# EAGLE design mux_ic (EAGLE 9.6.1)
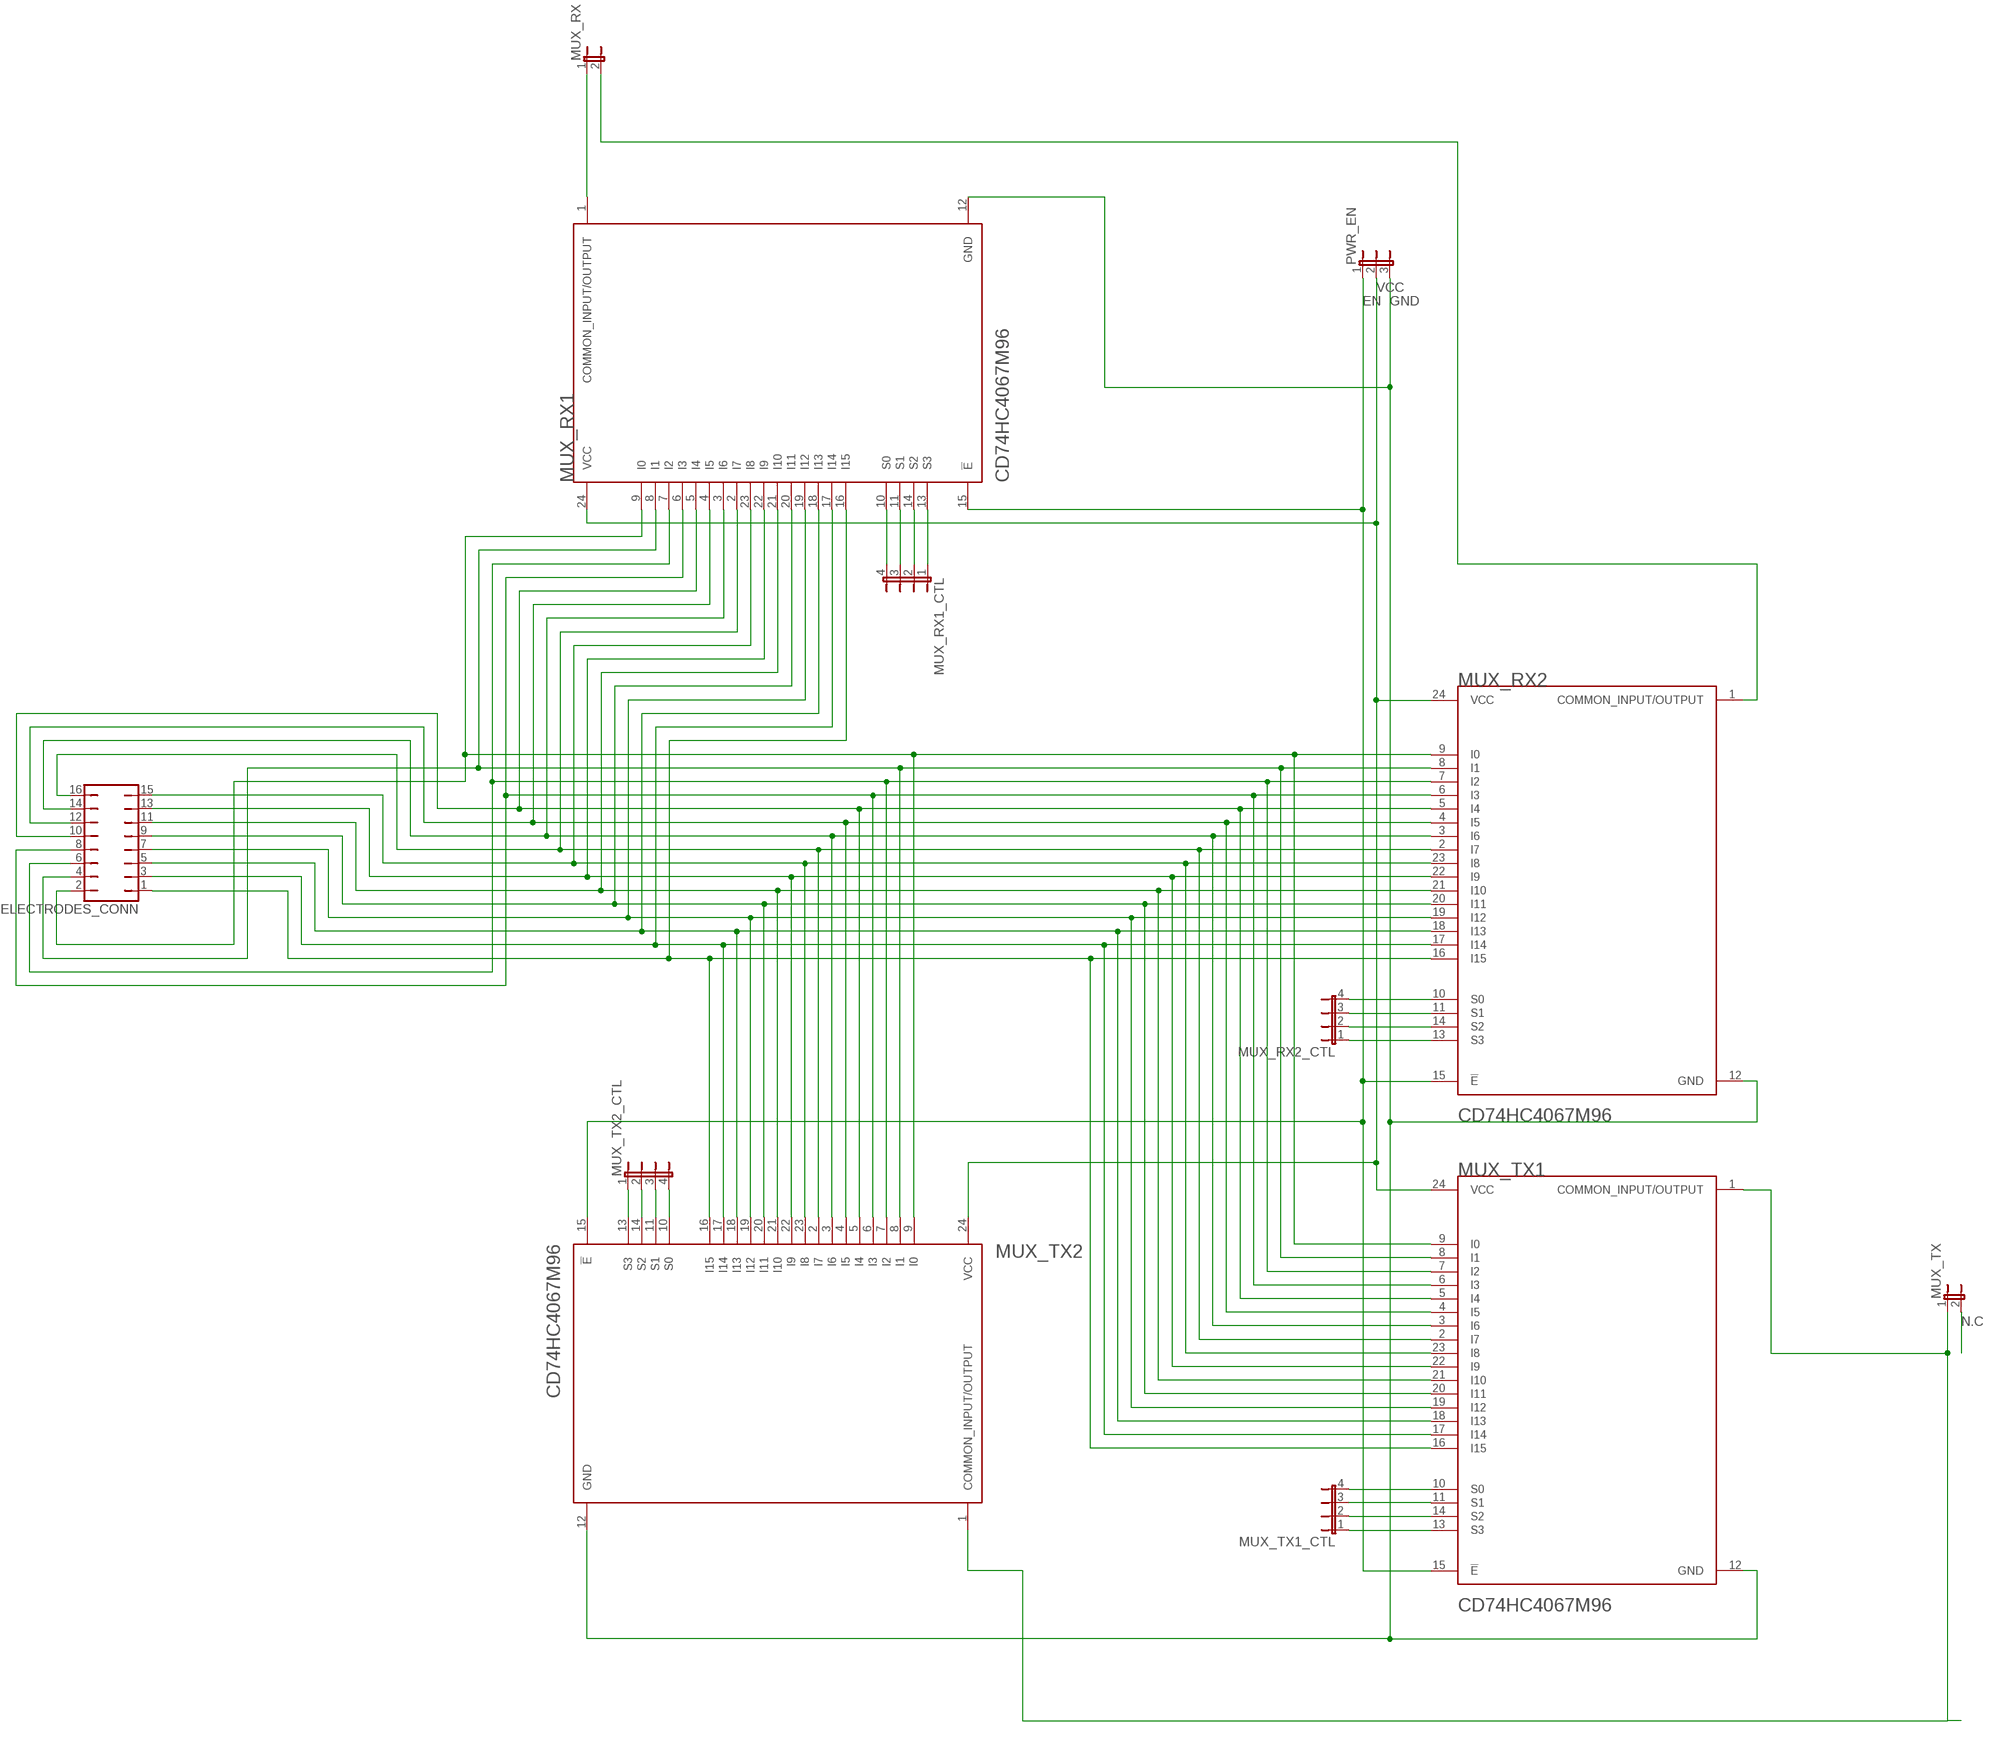
[diagram p0: schematic, sheet 1]

## Parts
ELECTRODES_CONN  JP8Q  [JP8Q]
MUX_RX  JP1E  [JP1]
MUX_RX1  TEXAS_INSTRUMENTS_CD74HC4067M96TEXAS_INSTRUMENTS_CD74HC4067M96_0_0  [TEXAS_INSTRUMENTS_CD74HC4067M96_0]
MUX_RX1_CTL  JP4E  [JP4]
MUX_RX2  TEXAS_INSTRUMENTS_CD74HC4067M96TEXAS_INSTRUMENTS_CD74HC4067M96_0_0  [TEXAS_INSTRUMENTS_CD74HC4067M96_0]
MUX_RX2_CTL  JP4E  [JP4]
MUX_TX  JP1E  [JP1]
MUX_TX1  TEXAS_INSTRUMENTS_CD74HC4067M96TEXAS_INSTRUMENTS_CD74HC4067M96_0_0  [TEXAS_INSTRUMENTS_CD74HC4067M96_0]
MUX_TX1_CTL  JP4E  [JP4]
MUX_TX2  TEXAS_INSTRUMENTS_CD74HC4067M96TEXAS_INSTRUMENTS_CD74HC4067M96_0_0  [TEXAS_INSTRUMENTS_CD74HC4067M96_0]
MUX_TX2_CTL  JP4E  [JP4]
PWR_EN  JP2W  [JP2W]

## Nets
EN: MUX_RX1.15(!E!) MUX_RX2.15(!E!) MUX_TX1.15(!E!) MUX_TX2.15(!E!) PWR_EN.1
GND: MUX_RX1.12(GND) MUX_RX2.12(GND) MUX_TX1.12(GND) MUX_TX2.12(GND) PWR_EN.3
N$1: ELECTRODES_CONN.2 MUX_RX1.9(I0) MUX_RX2.9(I0) MUX_TX1.9(I0) MUX_TX2.9(I0)
N$2: ELECTRODES_CONN.1 ELECTRODES_CONN.3 ELECTRODES_CONN.4 ELECTRODES_CONN.5 ELECTRODES_CONN.6 ELECTRODES_CONN.7 ELECTRODES_CONN.8 ELECTRODES_CONN.9 ELECTRODES_CONN.10 ELECTRODES_CONN.12 ELECTRODES_CONN.13 ELECTRODES_CONN.14 ELECTRODES_CONN.15 ELECTRODES_CONN.16 MUX_RX1.2(I7) MUX_RX1.3(I6) MUX_RX1.4(I5) MUX_RX1.5(I4) MUX_RX1.6(I3) MUX_RX1.7(I2) MUX_RX1.8(I1) MUX_RX1.16(I15) MUX_RX1.17(I14) MUX_RX1.18(I13) MUX_RX1.19(I12) MUX_RX1.20(I11) MUX_RX1.22(I9) MUX_RX1.23(I8) MUX_RX2.2(I7) MUX_RX2.3(I6) MUX_RX2.4(I5) MUX_RX2.5(I4) MUX_RX2.6(I3) MUX_RX2.7(I2) MUX_RX2.8(I1) MUX_RX2.16(I15) MUX_RX2.17(I14) MUX_RX2.18(I13) MUX_RX2.19(I12) MUX_RX2.20(I11) MUX_RX2.22(I9) MUX_RX2.23(I8) MUX_TX1.2(I7) MUX_TX1.3(I6) MUX_TX1.4(I5) MUX_TX1.5(I4) MUX_TX1.6(I3) MUX_TX1.7(I2) MUX_TX1.8(I1) MUX_TX1.16(I15) MUX_TX1.17(I14) MUX_TX1.18(I13) MUX_TX1.19(I12) MUX_TX1.20(I11) MUX_TX1.22(I9) MUX_TX1.23(I8) MUX_TX2.2(I7) MUX_TX2.3(I6) MUX_TX2.4(I5) MUX_TX2.5(I4) MUX_TX2.6(I3) MUX_TX2.7(I2) MUX_TX2.8(I1) MUX_TX2.16(I15) MUX_TX2.17(I14) MUX_TX2.18(I13) MUX_TX2.19(I12) MUX_TX2.20(I11) MUX_TX2.22(I9) MUX_TX2.23(I8)
N$3: MUX_RX1.1(COMMON_INPUT/OUTPUT) MUX_RX.1
N$4: MUX_RX2.1(COMMON_INPUT/OUTPUT) MUX_RX.2
N$5: MUX_TX1.1(COMMON_INPUT/OUTPUT) MUX_TX2.1(COMMON_INPUT/OUTPUT) MUX_TX.1
N$6: ELECTRODES_CONN.11 MUX_RX1.21(I10) MUX_RX2.21(I10) MUX_TX1.21(I10) MUX_TX2.21(I10)
N$11: MUX_TX1.10(S0) MUX_TX1_CTL.4
N$12: MUX_TX1.11(S1) MUX_TX1_CTL.3
N$13: MUX_TX1.14(S2) MUX_TX1_CTL.2
N$14: MUX_TX1.13(S3) MUX_TX1_CTL.1
N$15: MUX_TX2.13(S3) MUX_TX2_CTL.1
N$16: MUX_TX2.14(S2) MUX_TX2_CTL.2
N$17: MUX_TX2.11(S1) MUX_TX2_CTL.3
N$18: MUX_TX2.10(S0) MUX_TX2_CTL.4
N$19: MUX_RX2.10(S0) MUX_RX2_CTL.4
N$20: MUX_RX2.11(S1) MUX_RX2_CTL.3
N$21: MUX_RX2.14(S2) MUX_RX2_CTL.2
N$22: MUX_RX2.13(S3) MUX_RX2_CTL.1
N$23: MUX_RX1.10(S0) MUX_RX1_CTL.4
N$24: MUX_RX1.11(S1) MUX_RX1_CTL.3
N$25: MUX_RX1.14(S2) MUX_RX1_CTL.2
N$26: MUX_RX1.13(S3) MUX_RX1_CTL.1
N.C: MUX_TX.2
VCC: MUX_RX1.24(VCC) MUX_RX2.24(VCC) MUX_TX1.24(VCC) MUX_TX2.24(VCC) PWR_EN.2

## Library data of the parts
ELECTRODES_CONN = jumper:JP8Q: JUMPER
MUX_RX MUX_TX = jumper:JP1E: JUMPER
MUX_RX1 MUX_RX2 MUX_TX1 MUX_TX2 = Texas Instruments - CD74HC4067M96:TEXAS_INSTRUMENTS_CD74HC4067M96: High-speed CMOS 16-channel analog multiplexer/demultiplexer 24-SOIC -55 to 125; AMBIENT_TEMPERATURE_RANGE_HIGH: +125°C; AMBIENT_TEMPERATURE_RANGE_LOW: -55°C; AUTOMOTIVE: No; CENTROID_NOT_SPECIFIED: No; DATASHEET: http://www.ti.com/lit/ds/symlink/cd74hc4067.pdf; DEVICE_CLASS_L1: Integrated Circuits (ICs); DEVICE_CLASS_L2: Logic ICs; DEVICE_CLASS_L3: Multiplexers; DIGIKEY_DESCRIPTION: IC MUX/DEMUX 1X16 24SOIC; DIGIKEY_PART_NUMBER: 296-29408-1-ND; FOOTPRINT_PARAMETERS_1: {"fp_type":"SOIC_narrow","params":{"N":{"nom":24,"long name":"Number of leads","min":null,"max":null,"short name":"N","type":"count"},"A":{"nom":false,"long name":"Height","min":false,"max":2650000,"short name":"A","type":"measurement"},"A1":{"nom":false,"long name":"Package clearance","min":100000,"max":300000,"short name":"A1","type":"measurement"},"A2":{"nom":false,"long name":"Package height","min":false,"max":2550000,"short name":"A2","type":"measurement"},"D":{"nom":false,"long name":"Package length","min":15200000,"max":15600000,"short name":"D","type":"measurement"},"E":{"nom":false,"long name":"Width w/ leads","min":9970000,"max":10630000,"short name":"E","type":"measurement"},"E1":{"nom":false,"long name":"Package width","min":7400000,"max":7600000,"short name":"E1","type":"measurement"},"B":{"nom":false,"long name":"Lead width","min":310000,"max":510000,"short name":"B","type":"measurement"},"C":{"nom":false,"long name":"Lead thickness","min":200000,"max":330000,"short name":"C","type":"measurement"},"e":{"nom":1270000,"long name":"Lead pitch","min":null,"max":null,"short name":"e","type":"measurement"},"L":{"nom":false,"long name":"Lead foot length","min":400000,"max":1270000,"short name":"L","type":"measurement"},"PHI":{"nom":false,"long name":"Lead foot angle","min":0,"max":8000000,"short name":"PHI","type":"measurement"},"HT":{"default":"No","long name":"Thermal pad","type":"multichoiceparent","short name":"HT","children":[]},"offset x":{"nom":0,"long name":"X Center offset","min":null,"max":null,"short name":"offset x","type":"measurement"},"offset y":{"nom":0,"long name":"Y Center offset","min":null,"max":null,"short name":"offset y","type":"measurement"},"LS":{"default":"Rounded rectangle","long name":"Land shape","type":"multichoice","short name":"LS"},"LS1":{"default":"Rectangle","long name":"Land shape (Pin 1)","type":"multichoice","short name":"LS1"},"solder toe":{"nom":550000,"long name":"Solder fillet (toe)","min":null,"max":null,"short name":"solder toe","type":"fixedmeasurement"},"solder heel":{"nom":450000,"long name":"Solder fillet (heel)","min":null,"max":null,"short name":"solder heel","type":"fixedmeasurement"},"solder side":{"nom":50000,"long name":"Solder fillet (side)","min":null,"max":null,"short name":"solder side","type":"fixedmeasurement"},"courtyard":{"nom":500000,"long name":"Courtyard","min":null,"max":null,"short name":"courtyard","type":"fixedmeasurement"},"SF":{"default":"A","long name":"Packing level","type":"multichoiceparent","short name":"SF","help":"http://support.upverter.com/customer/portal/articles/978783-what-is-a-footprint-packing-level","children":["solder toe","solder heel","solder side","courtyard"]}}}; FOOTPRINT_PARAMETERS_2: {"fp_type":"SOIC_narrow","params":{"N":{"nom":24,"long name":"Number of leads","min":null,"max":null,"short name":"N","type":"count"},"A":{"nom":false,"long name":"Height","min":false,"max":2650000,"short name":"A","type":"measurement"},"A1":{"nom":false,"long name":"Package clearance","min":100000,"max":300000,"short name":"A1","type":"measurement"},"A2":{"nom":false,"long name":"Package height","min":false,"max":2550000,"short name":"A2","type":"measurement"},"D":{"nom":false,"long name":"Package length","min":15200000,"max":15600000,"short name":"D","type":"measurement"},"E":{"nom":false,"long name":"Width w/ leads","min":9970000,"max":10630000,"short name":"E","type":"measurement"},"E1":{"nom":false,"long name":"Package width","min":7400000,"max":7600000,"short name":"E1","type":"measurement"},"B":{"nom":false,"long name":"Lead width","min":310000,"max":510000,"short name":"B","type":"measurement"},"C":{"nom":false,"long name":"Lead thickness","min":200000,"max":330000,"short name":"C","type":"measurement"},"e":{"nom":1270000,"long name":"Lead pitch","min":null,"max":null,"short name":"e","type":"measurement"},"L":{"nom":false,"long name":"Lead foot length","min":400000,"max":1270000,"short name":"L","type":"measurement"},"PHI":{"nom":false,"long name":"Lead foot angle","min":0,"max":8000000,"short name":"PHI","type":"measurement"},"HT":{"default":"No","long name":"Thermal pad","type":"multichoiceparent","short name":"HT","children":[]},"offset x":{"nom":0,"long name":"X Center offset","min":null,"max":null,"short name":"offset x","type":"measurement"},"offset y":{"nom":0,"long name":"Y Center offset","min":null,"max":null,"short name":"offset y","type":"measurement"},"LS":{"default":"Rounded rectangle","long name":"Land shape","type":"multichoice","short name":"LS"},"LS1":{"default":"Rectangle","long name":"Land shape (Pin 1)","type":"multichoice","short name":"LS1"},"solder toe":{"nom":350000,"long name":"Solder fillet (toe)","min":null,"max":null,"short name":"solder toe","type":"fixedmeasurement"},"solder heel":{"nom":350000,"long name":"Solder fillet (heel)","min":null,"max":null,"short name":"solder heel","type":"fixedmeasurement"},"solder side":{"nom":30000,"long name":"Solder fillet (side)","min":null,"max":null,"short name":"solder side","type":"fixedmeasurement"},"courtyard":{"nom":250000,"long name":"Courtyard","min":null,"max":null,"short name":"courtyard","type":"fixedmeasurement"},"SF":{"default":"B","long name":"Packing level","type":"multichoiceparent","short name":"SF","help":"http://support.upverter.com/customer/portal/articles/978783-what-is-a-footprint-packing-level","children":["solder toe","solder heel","solder side","courtyard"]}}}; FOOTPRINT_PARAMETERS_3: {"fp_type":"SOIC_narrow","params":{"N":{"nom":24,"long name":"Number of leads","min":null,"max":null,"short name":"N","type":"count"},"A":{"nom":false,"long name":"Height","min":false,"max":2650000,"short name":"A","type":"measurement"},"A1":{"nom":false,"long name":"Package clearance","min":100000,"max":300000,"short name":"A1","type":"measurement"},"A2":{"nom":false,"long name":"Package height","min":false,"max":2550000,"short name":"A2","type":"measurement"},"D":{"nom":false,"long name":"Package length","min":15200000,"max":15600000,"short name":"D","type":"measurement"},"E":{"nom":false,"long name":"Width w/ leads","min":9970000,"max":10630000,"short name":"E","type":"measurement"},"E1":{"nom":false,"long name":"Package width","min":7400000,"max":7600000,"short name":"E1","type":"measurement"},"B":{"nom":false,"long name":"Lead width","min":310000,"max":510000,"short name":"B","type":"measurement"},"C":{"nom":false,"long name":"Lead thickness","min":200000,"max":330000,"short name":"C","type":"measurement"},"e":{"nom":1270000,"long name":"Lead pitch","min":null,"max":null,"short name":"e","type":"measurement"},"L":{"nom":false,"long name":"Lead foot length","min":400000,"max":1270000,"short name":"L","type":"measurement"},"PHI":{"nom":false,"long name":"Lead foot angle","min":0,"max":8000000,"short name":"PHI","type":"measurement"},"HT":{"default":"No","long name":"Thermal pad","type":"multichoiceparent","short name":"HT","children":[]},"offset x":{"nom":0,"long name":"X Center offset","min":null,"max":null,"short name":"offset x","type":"measurement"},"offset y":{"nom":0,"long name":"Y Center offset","min":null,"max":null,"short name":"offset y","type":"measurement"},"LS":{"default":"Rounded rectangle","long name":"Land shape","type":"multichoice","short name":"LS"},"LS1":{"default":"Rectangle","long name":"Land shape (Pin 1)","type":"multichoice","short name":"LS1"},"solder toe":{"nom":150000,"long name":"Solder fillet (toe)","min":null,"max":null,"short name":"solder toe","type":"fixedmeasurement"},"solder heel":{"nom":250000,"long name":"Solder fillet (heel)","min":null,"max":null,"short name":"solder heel","type":"fixedmeasurement"},"solder side":{"nom":10000,"long name":"Solder fillet (side)","min":null,"max":null,"short name":"solder side","type":"fixedmeasurement"},"courtyard":{"nom":100000,"long name":"Courtyard","min":null,"max":null,"short name":"courtyard","type":"fixedmeasurement"},"SF":{"default":"C","long name":"Packing level","type":"multichoiceparent","short name":"SF","help":"http://support.upverter.com/customer/portal/articles/978783-what-is-a-footprint-packing-level","children":["solder toe","solder heel","solder side","courtyard"]}}}; FOOTPRINT_VARIANT_NAME_0: Recommended_Land_Pattern; FOOTPRINT_VARIANT_NAME_1: IPC_A; FOOTPRINT_VARIANT_NAME_2: IPC_B; FOOTPRINT_VARIANT_NAME_3: IPC_C; HEIGHT: 2.65mm; IPC_LAND_PATTERN_NAME: SOIC127P1030X265-24; LEAD_FREE: Yes; LOGIC_FUNCTION_DESC: Non-Inverting; MAX_JUNCTION_TEMP: +150°C; MAX_SUPPLY_VOLTAGE: 6V; MF: Texas Instruments; MFG_PACKAGE_IDENT: DW0024A; MFG_PACKAGE_IDENT_COMPONENT_ID: 7ddb0374575ad7a2; MFG_PACKAGE_IDENT_DATE: 0; MFG_PACKAGE_IDENT_REV: 0; MIN_SUPPLY_VOLTAGE: 2V; MOUSER_DESCRIPTION: Multiplexer Switch ICs Hi-Spd CMOS 16Ch Anl Mltplxr/Demltplxr; MOUSER_PART_NUMBER: 595-CD74HC4067M96; MPN: CD74HC4067M96; NUMBER_OF_CIRCUITS: 1; NUMBER_OF_INPUTS: 16; NUMBER_OF_OUTPUTS: 1; PACKAGE: SOIC24; PREFIX: U; PROPAGATION_DELAY: 6ns; QUIESCENT_CURRENT: 8uA; ROHS: Yes; STANDOFF_HEIGHT: 0.1mm; TEMPERATURE_RANGE_HIGH: +125°C; TEMPERATURE_RANGE_LOW: -55°C; VERIFICATION_VERSION: 0.0.0.3
MUX_RX1_CTL MUX_RX2_CTL MUX_TX1_CTL MUX_TX2_CTL = jumper:JP4E: JUMPER
PWR_EN = jumper:JP2W: JUMPER

## Board
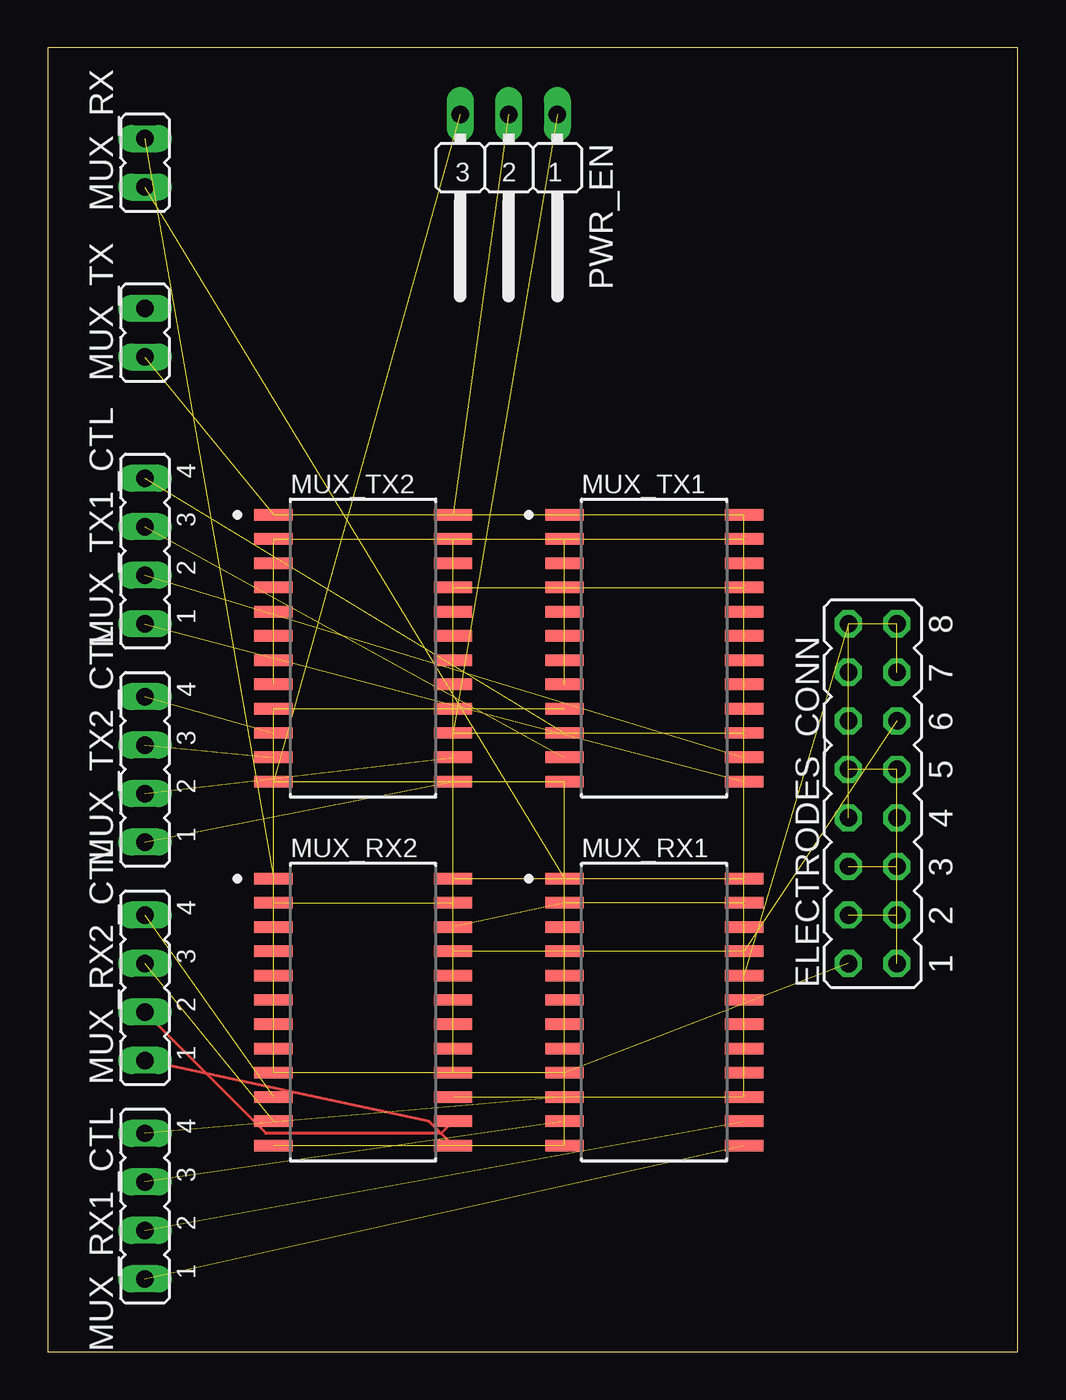
[diagram p1: board, top side]

Size 50.78 x 68.25 mm. Coordinates in mm from the lower left corner, seen from the top.
Outline: 0,0 50.78,0 50.78,68.25 0,68.25 0,0
Copper layers (1*16): Top 0.035mm / dielectric 1.5mm / Bottom 0.035mm
Design rules "default": minimum track width 6mil, minimum drill 0.35mm, track to track 6mil, track to pad 6mil, pad to pad 6mil, via to via 6mil, smd to smd 6mil, copper to edge 40mil, drill to drill 6mil, minimum pad ring 10mil, minimum via ring 8mil, stop-mask expansion 4mil, vias tented up to drill 0mil, thermal gap 10mil

### Footprints (pad centres in the part's own frame; a part is rotated, then mirrored left to right if it is on the bottom)
JP8Q = drill 0.914 octagon: 1 -8.89,-1.27; 2 -8.89,1.27; 3 -6.35,-1.27; 4 -6.35,1.27; 5 -3.81,-1.27; 6 -3.81,1.27; 7 -1.27,-1.27; 8 -1.27,1.27; 9 1.27,-1.27; 10 1.27,1.27; 11 3.81,-1.27; 12 3.81,1.27; 13 6.35,-1.27; 14 6.35,1.27; 15 8.89,-1.27; 16 8.89,1.27
JP1 = drill 0.914 long: 1 0,-1.27; 2 0,1.27
TEXAS_INSTRUMENTS_CD74HC4067M96_0 = smd 2 x 0.6: 1 -4.7,6.985; 2 -4.7,5.715; 3 -4.7,4.445; 4 -4.7,3.175; 5 -4.7,1.905; 6 -4.7,0.635; 7 -4.7,-0.635; 8 -4.7,-1.905; 9 -4.7,-3.175; 10 -4.7,-4.445; 11 -4.7,-5.715; 12 -4.7,-6.985; 13 4.7,-6.985; 14 4.7,-5.715; 15 4.7,-4.445; 16 4.7,-3.175; 17 4.7,-1.905; 18 4.7,-0.635; 19 4.7,0.635; 20 4.7,1.905; 21 4.7,3.175; 22 4.7,4.445; 23 4.7,5.715; 24 4.7,6.985 | smd 1.95 x 0.55: SMD_25 4.7,-6.985; SMD_26 4.7,-5.715; SMD_27 4.7,-4.445; SMD_28 4.7,-3.175; SMD_29 4.7,-1.905; SMD_30 4.7,-0.635; SMD_31 4.7,0.635; SMD_32 4.7,1.905; SMD_33 4.7,3.175; SMD_34 4.7,4.445; SMD_35 4.7,5.715; SMD_36 4.7,6.985; SMD_37 -4.7,6.985; SMD_38 -4.7,5.715; SMD_39 -4.7,4.445; SMD_40 -4.7,3.175; SMD_41 -4.7,1.905; SMD_42 -4.7,0.635; SMD_43 -4.7,-0.635; SMD_44 -4.7,-1.905; SMD_45 -4.7,-3.175; SMD_46 -4.7,-4.445; SMD_47 -4.7,-5.715; SMD_48 -4.7,-6.985
JP4 = drill 0.914 long: 1 -3.81,0; 2 -1.27,0; 3 1.27,0; 4 3.81,0
JP2W = drill 0.914 long: 1 -2.54,-1.27; 2 0,-1.27; 3 2.54,-1.27

### Placement (x,y rotation side)
ELECTRODES_CONN  43.18,29.21 90 top
MUX_RX  5.08,62.23 0 top
MUX_RX1  31.75,17.78 0 top
MUX_RX1_CTL  5.08,7.62 90 top
MUX_RX2  16.51,17.78 0 top
MUX_RX2_CTL  5.08,19.05 90 top
MUX_TX  5.08,53.34 0 top
MUX_TX1  31.75,36.83 0 top
MUX_TX1_CTL  5.08,41.91 90 top
MUX_TX2  16.51,36.83 0 top
MUX_TX2_CTL  5.08,30.48 90 top
PWR_EN  24.13,63.5 180 top

### Tracks (layer width: path | path; a pad name or v marks a point on that pad's centre or on a via)
EN  (4 unrouted)
GND  (4 unrouted)
N$1  (4 unrouted)
N$2  (69 unrouted)
N$3  (1 unrouted)
N$4  (1 unrouted)
N$5  (2 unrouted)
N$6  (4 unrouted)
N$11  (1 unrouted)
N$12  (1 unrouted)
N$13  (1 unrouted)
N$14  (1 unrouted)
N$15  (1 unrouted)
N$16  (1 unrouted)
N$17  (1 unrouted)
N$18  (1 unrouted)
N$19  (1 unrouted)
N$20  (1 unrouted)
N$21
  Top 0.152: MUX_RX2_CTL.2 11.43,11.43 20.57,11.43 MUX_RX2.14
N$22
  Top 0.152: MUX_RX2.13 19.95,12.05 MUX_RX2_CTL.1
N$23  (1 unrouted)
N$24  (1 unrouted)
N$25  (1 unrouted)
N$26  (1 unrouted)
VCC  (4 unrouted)